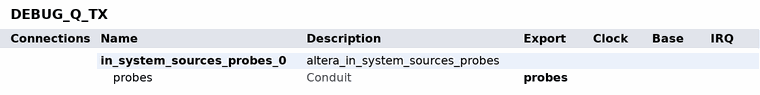
[diagram p0: system contents]
# Platform Designer (Qsys) system DEBUG_Q_TX, Cyclone IV E EP4CE22E22C8
# Parameters at their usual value, and those the tool derives, are not listed.
package require -exact qsys 17.1
create_system DEBUG_Q_TX
set_project_property DEVICE_FAMILY {Cyclone IV E}
set_project_property DEVICE EP4CE22E22C8

add_instance in_system_sources_probes_0 altera_in_system_sources_probes 17.1
set_instance_property in_system_sources_probes_0 AUTO_EXPORT true
set_instance_parameter_value in_system_sources_probes_0 create_source_clock false
set_instance_parameter_value in_system_sources_probes_0 instance_id Q_TX
set_instance_parameter_value in_system_sources_probes_0 probe_width 16
set_instance_parameter_value in_system_sources_probes_0 source_width 0

# exported interfaces
add_interface probes conduit end
set_interface_property probes EXPORT_OF in_system_sources_probes_0.probes

set_interconnect_requirement {$system} qsys_mm.clockCrossingAdapter HANDSHAKE
set_interconnect_requirement {$system} qsys_mm.enableEccProtection FALSE
set_interconnect_requirement {$system} qsys_mm.insertDefaultSlave FALSE
set_interconnect_requirement {$system} qsys_mm.maxAdditionalLatency 1

save_system DEBUG_Q_TX.qsys
